# EAGLE design ESP Breakout Adapter - v2_0A - AS1363 (EAGLE 7.3.0)
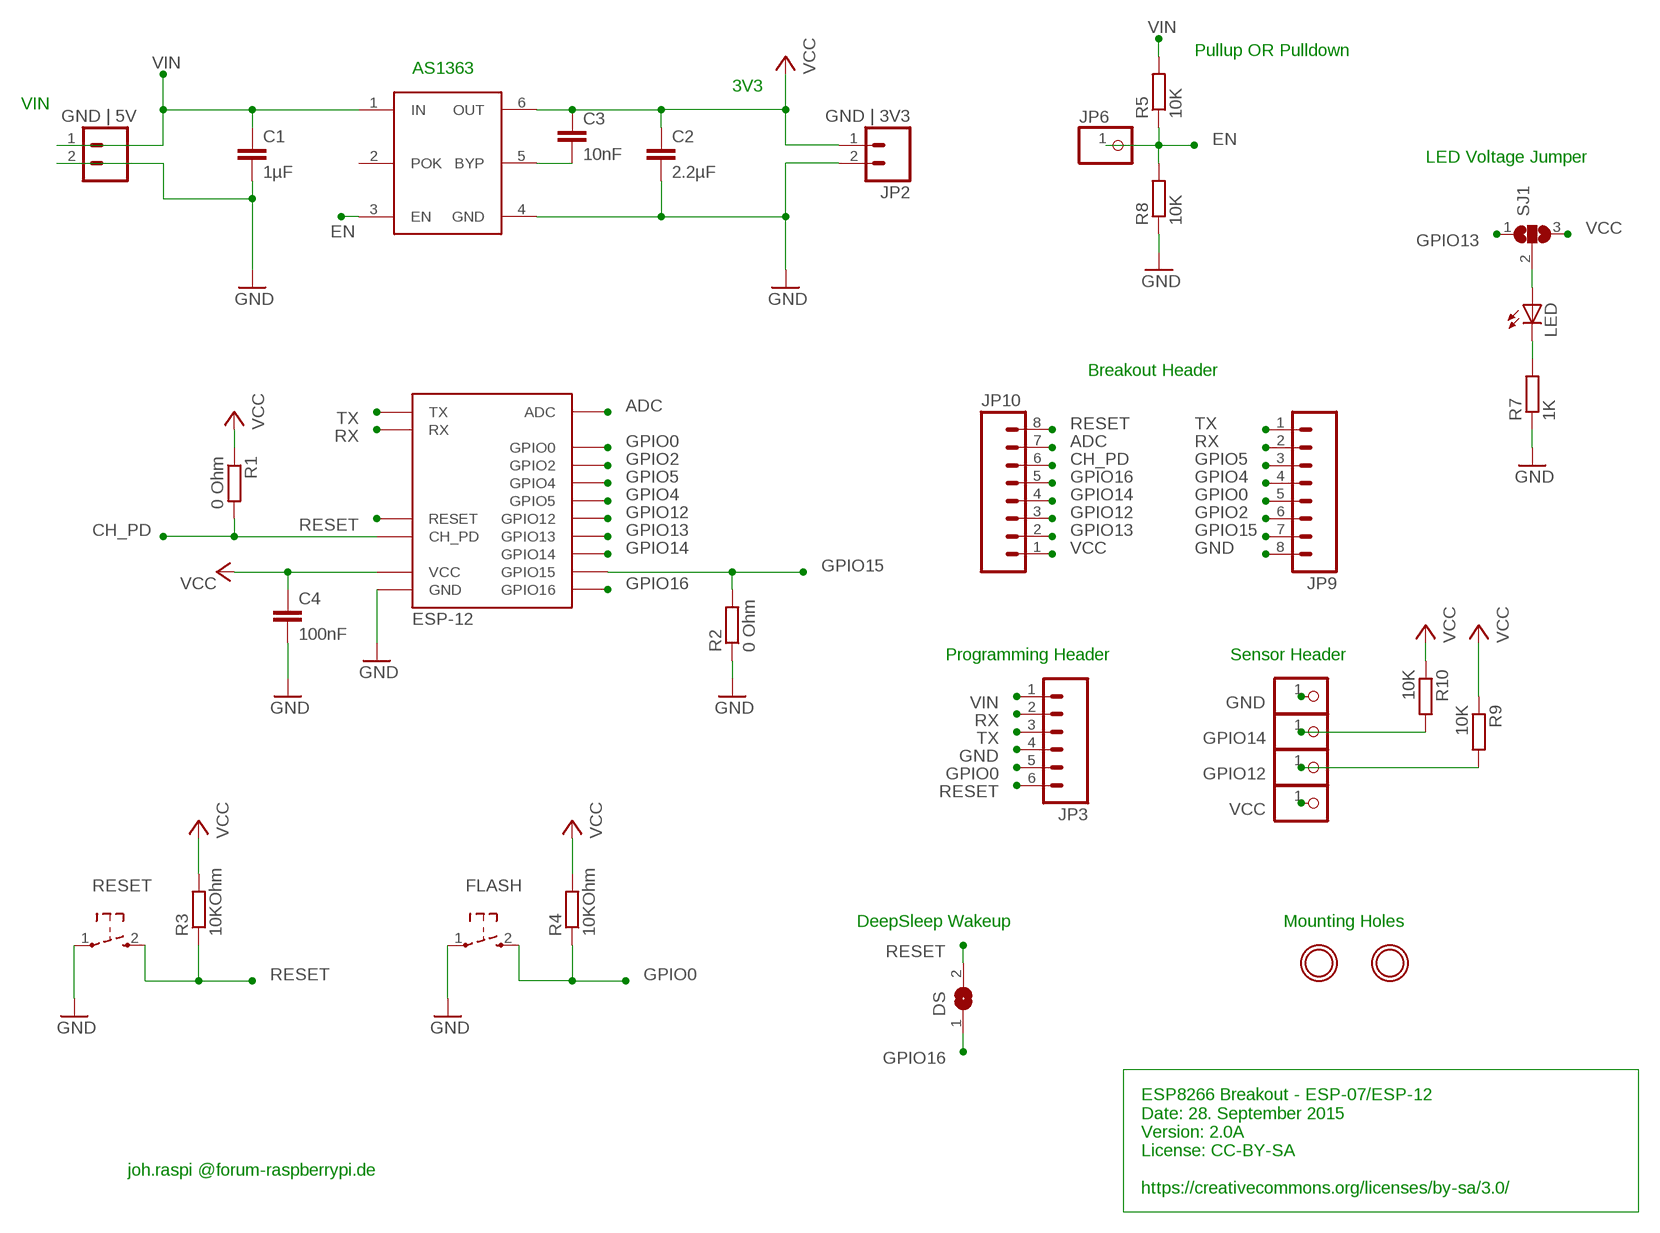
[diagram p0: schematic, sheet 1]

## Parts
AS1363  AS1363  [SOT23-6]
C1  1µF  C-EUC1206  [C1206]
C2  2.2µF  C-EUC1206  [C1206]
C3  10nF  C-EUC0603K  [C0603K]
C4  100nF  C-EUC0805  [C0805]
DS  SJ  [SJ]
FLASH  SW_TACT_2P-3X6  [SW_TACT_3X6]
JP2  GND | 3V3  M02PTH  [1X02]
JP3  M06SIP  [1X06]
JP4  PINHD-1X1  [1X01]
JP6  PINHD-1X1  [1X01]
JP7  PINHD-1X1  [1X01]
JP8  PINHD-1X1  [1X01]
JP9  M081X08  [1X08]
JP10  M081X08  [1X08]
JP11  PINHD-1X1  [1X01]
LED  LED-0805  [LED-805]
R1  0 Ohm  R-EU_R0805  [R0805]
R2  0 Ohm  R-EU_R0805  [R0805]
R3  10KOhm  R-EU_R0805  [R0805]
R4  10KOhm  R-EU_R0805  [R0805]
R5  10K  R-EU_R0805  [R0805]
R7  1K  R-EU_R0805  [R0805]
R8  10K  R-EU_R0805  [R0805]
R9  10K  R-EU_R0805  [R0805]
R10  10K  R-EU_R0805  [R0805]
RESET  SW_TACT_2P-3X6  [SW_TACT_3X6]
SJ1  SJ2W  [SJ_2]
U$1  ESP-12  [ESP-12]
U$4  MOUNTINGHOLE2.0  [MOUNTINGHOLE_2.0_PLATED]
U$5  MOUNTINGHOLE2.0  [MOUNTINGHOLE_2.0_PLATED]
VIN  GND | 5V  M02PTH  [1X02]

## Nets
ADC: JP10.7 U$1.ADC
CH_PD: JP10.6 R1.2 U$1.CH_PD
EN: AS1363.3(EN) JP6.1 R5.1 R8.2
GND [a]: AS1363.4(GND) C1.2 C2.2 C4.2 FLASH.1 JP2.2 JP3.4 JP4.1 JP9.8 R2.1 R7.1 R8.1 RESET.1 U$1.GND VIN.2
GPIO0: FLASH.2 JP3.5 JP9.5 R4.1 U$1.GPIO0
GPIO2: JP9.6 U$1.GPIO2
GPIO4: JP9.4 U$1.GPIO5
GPIO5: JP9.3 U$1.GPIO4
GPIO12: JP7.1 JP10.3 R9.2 U$1.GPIO12
GPIO13: JP10.2 SJ1.1 U$1.GPIO13
GPIO14: JP10.4 JP11.1 R10.2 U$1.GPIO14
GPIO15: JP9.7 R2.2 U$1.GPIO15
GPIO16: DS.1 JP10.5 U$1.GPIO16
N$3: LED.C R7.2
N$4: LED.A SJ1.2
RESET: DS.2 JP3.6 JP10.8 R3.1 RESET.2 U$1.RESET
RX: JP3.2 JP9.2 U$1.RX
SET/BYP: AS1363.5(BYP) C3.2
TX: JP3.3 JP9.1 U$1.TX
VCC: AS1363.6(OUT) C2.1 C3.1 C4.1 JP2.1 JP8.1 JP10.1 R1.1 R3.2 R4.2 R9.1 R10.1 SJ1.3 U$1.VCC
VIN: AS1363.1(IN) C1.1 JP3.1 R5.2 VIN.1
Unconnected: AS1363.2(POK)

## Notes on the sheet
- Pullup OR Pulldown
- AS1363
- 3V3
- VIN
- LED Voltage Jumper
- Breakout Header
- Programming Header | Sensor Header
- DeepSleep Wakeup | Mounting Holes
- joh.raspi @forum-raspberrypi.de
- ESP8266 Breakout - ESP-07/ESP-12
  Date: 28. September 2015
  Version: 2.0A
  License: CC-BY-SA
  
  https://creativecommons.org/licenses/by-sa/3.0/

## Library data of the parts
AS1363 = joh_as1363:AS1363: 500mA ultra-low-dropout linear regulator 1.2V-5V 40µA quiescen current Source: http://ams.com/eng/content/download/12507/219217/12422
C1-C4 = rcl:C-EU: CAPACITOR, European symbol
DS = jumper:SJ: SMD solder JUMPER
FLASH RESET = dp-devices:SW_TACT_2P
JP2 VIN = SparkFun:M02: Header 2 Standard 2-pin 0.1" header. Use with straight break away headers (SKU : PRT-00116), right angle break away headers (PRT-00553), swiss pins (PRT-00743), machine pins (PRT-00117), and female headers (PRT-00115). Molex polarized connector foot print use with SKU : PRT-08233 with associated crimp pins and housings.
JP3 = SparkFun:M06: Header 6 Standard 6-pin 0.1" header. Use with straight break away headers (SKU : PRT-00116), right angle break away headers (PRT-00553), swiss pins (PRT-00743), machine pins (PRT-00117), and female headers (PRT-00115). Molex polarized connector foot print use with SKU : PRT-08094 with associated crimp pins and housings. NOTES ON THE VARIANTS LOCK and LOCK_LONGPADS... This footprint was designed to help hold the alignment of a through-hole component (i.e. 6-pin header) while soldering it into place. You may notice that each hole has been shifted either up or down by 0.005 of an inch from it's more standard position (which is a perfectly straight line). This slight alteration caused the pins (the squares in the middle) to touch the edges of the holes. Because they are alternating, it causes a "brace" to hold the component in place. 0.005 has proven to be the perfect amount of "off-center" position when using our standard breakaway headers. Although looks a little odd when you look at the bare footprint, once you have a header in there, the alteration is very hard to notice. Also, if you push a header all the way into place, it is covered up entirely on the bottom side. This idea of altering the position of holes to aid alignment will be further integrated into the Sparkfun Library for other footprints. It can help hold any component with 3 or more connection pins.
JP4 JP6-JP8 JP11 = pinhead:PINHD-1X1: PIN HEADER
JP9 JP10 = SparkFun:M08: Header 8 Standard 8-pin 0.1" header. Use with straight break away headers (SKU : PRT-00116), right angle break away headers (PRT-00553), swiss pins (PRT-00743), machine pins (PRT-00117), and female headers (PRT-00115).
LED = dp-devices:LED: Light Emitting Diode
R1-R4 R7 = rcl:R-EU_: RESISTOR, European symbol
R5 R8-R10 = resistor:R-EU_: RESISTOR, European symbol
SJ1 = jumper:SJ2W: SMD solder JUMPER
U$1 = johs_esp8266_lib_frank_esp12e_mod:ESP-12: ESP8266 Wifi Module ESP-12; DIMENSIONS: 24.0 x 16.0 mm; PINS: 16; PITCH: 0.078" / 2 mm
U$4 U$5 = microbuilder:MOUNTINGHOLE: Mounting Hole For #2 screws (0.086"/2.18mm width, 0.094"/2.4mm hole) use 2.5mm

## Net classes
1 a: width 0.203 mm, drill 0.305 mm, clearance 0.203 mm

## Board
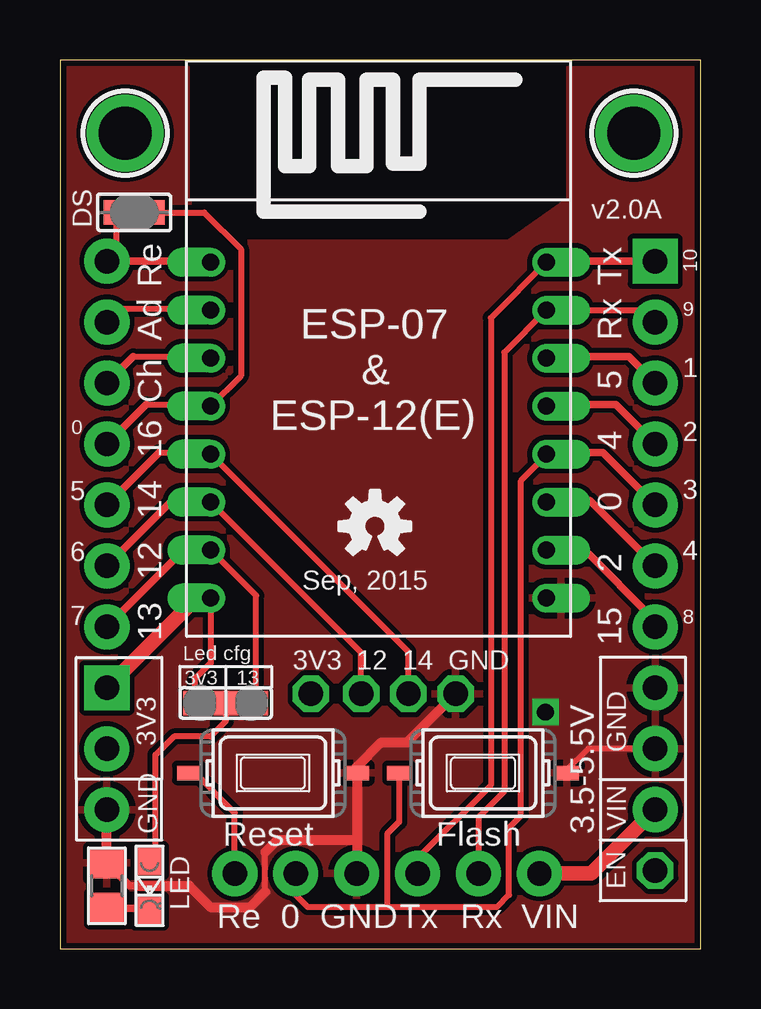
[diagram p1: board, top side]
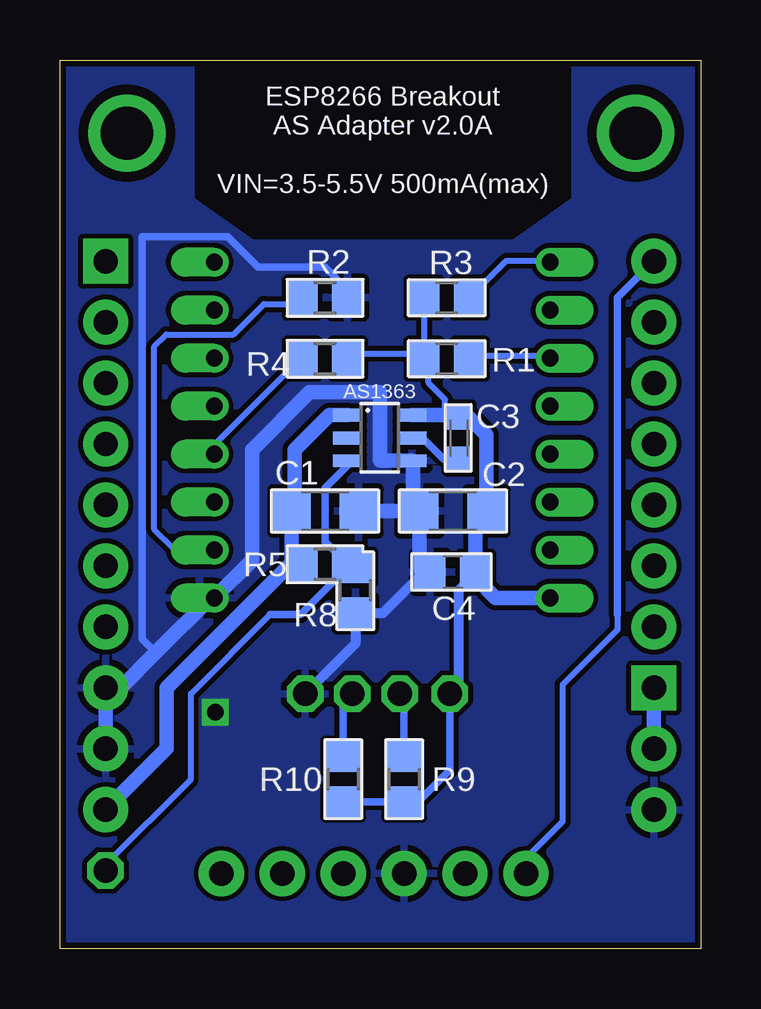
[diagram p2: board, bottom side, seen from below]

Size 26.72 x 37.05 mm. Coordinates in mm from the lower left corner, seen from the top.
Outline: 0,0 26.72,0 26.72,37.06 0,37.06 0,0
Copper layers (1*16): Top 0.035mm / dielectric 1.5mm / Bottom 0.035mm
Design rules "adafruit": minimum track width 10mil, minimum drill 15.5mil, track to track 8mil, track to pad 8mil, pad to pad 8mil, via to via 8mil, smd to smd 8mil, copper to edge 10mil, drill to drill 8mil, minimum pad ring 10mil, minimum via ring 8mil, stop-mask expansion 2mil, vias tented up to drill 20mil, thermal gap 10mil

### Footprints (pad centres in the part's own frame; a part is rotated, then mirrored left to right if it is on the bottom)
SOT23-6 = smd 0.533 x 1.219: 1 -0.95,-1.341; 2 0,-1.341; 3 0.95,-1.341; 4 0.95,1.341; 5 0,1.341; 6 -0.95,1.341
C1206 = smd 1.6 x 1.8: 1 -1.4,0; 2 1.4,0
C0603K = smd 1.05 x 1.08: 1 -0.875,0; 2 0.875,0
C0805 = smd 1.3 x 1.5: 1 -0.95,0; 2 0.95,0
SJ = smd 1.016 x 1.016: 1 -0.762,0; 2 0.762,0
SW_TACT_3X6 = smd 1 x 0.6: 1 -3.5,0; 2 3.5,0
1X02 = drill 1.016 pad 1.88: 1 0,0; 2 2.54,0
1X06 = drill 1.016 pad 1.88: 1 0,0; 2 2.54,0; 3 5.08,0; 4 7.62,0; 5 10.16,0; 6 12.7,0
1X01 = drill 1.016 octagon: 1 0,0
1X08 = drill 1.016 pad 1.88 square: 1 0,0 | drill 1.016 pad 1.88: 2 2.54,0; 3 5.08,0; 4 7.62,0; 5 10.16,0; 6 12.7,0; 7 15.24,0; 8 17.78,0
LED-805 = smd 1.2 x 1.2: A 0,-1.05; C 0,1.05
R0805 = smd 1.3 x 1.5: 1 -0.95,0; 2 0.95,0
SJ_2 = smd 1.016 x 1.016: 1 -1.27,0; 2 0,0; 3 1.27,0
ESP-12 = drill 0.7 offset: ADC -7.1,3.8; CH_PD -7.1,1.8; GND 6.9,-8.2; GPIO0 6.9,-2.2; GPIO2 6.9,-4.2; GPIO4 6.9,1.8; GPIO5 6.9,-0.2; GPIO12 -7.1,-4.2; GPIO13 -7.1,-6.2; GPIO14 -7.1,-2.2; GPIO15 6.9,-6.2; GPIO16 -7.1,-0.2; RESET -7.1,5.8; RX 6.9,3.8; TX 6.9,5.8; VCC -7.1,-8.2
MOUNTINGHOLE_2.0_PLATED = drill 2.2 pad 3: P$1 0,0

### Placement (x,y rotation side)
AS1363  13.39,21.3 270 bottom
C1  15.67,18.25 0 bottom
C2  10.34,18.25 180 bottom
C3  10.08,21.3 270 bottom
C4  10.34,15.71 180 bottom
DS  3.1,30.7 180 top
FLASH  17.64,7.33 180 top
JP2  1.95,8.34 270 top
JP3  19.99,3.14 180 top
JP4  16.5,10.63 0 top
JP6  24.82,3.27 0 top
JP7  12.56,10.63 0 top
JP8  10.47,10.63 0 top
JP9  24.82,28.67 270 top
JP10  1.96,10.89 90 top
JP11  14.53,10.63 0 top
LED  3.73,2.63 180 top
R1  10.59,24.6 0 bottom
R2  15.67,27.14 180 bottom
R3  10.59,27.14 180 bottom
R4  15.67,24.6 0 bottom
R5  15.67,16.03 180 bottom
R7  1.96,2.63 270 top
R8  14.4,14.95 90 bottom
R9  12.37,7.08 90 bottom
R10  14.91,7.08 90 bottom
RESET  8.88,7.33 180 top
SJ1  6.91,10.25 180 top
U$1  13.39,22.82 0 top
U$2  [OSHW-LOGO-S]  13.13,17.62 0 top
U$4  2.72,34 0 top
U$5  23.93,34 0 top
VIN  24.82,5.81 90 top

### Tracks (layer width: path | path; a pad name or v marks a point on that pad's centre or on a via)
ADC
  Top 0.254: 2.51,26.68 6.23,26.68 U$1.ADC
  Top 0.305: 2.51,26.68 JP10.7
CH_PD
  Top 0.254: 3.05,24.68 6.23,24.68 U$1.CH_PD
  Top 0.305: 3.05,24.68 JP10.6
  Bottom 0.254: U$1.CH_PD 6.39,24.73 9.54,24.73 9.54,24.71 R1.2
EN
  Bottom 0.254: 17.96,13.93 21.26,10.63 21.26,7.08 24.82,3.52 JP6.1 | R8.2 14.59,15.9 R5.1
  Bottom 0.305: 17.96,13.93 16.69,13.93 14.72,15.9 14.72,15.97 | 14.72,15.97 R5.1 15.67,16.98 15.67,19.21 14.73,20.16 AS1363.3 | 14.72,15.97
GND  (via drill 0.7)
  Top 0.254: VIN.2 22.03,8.35 21.14,7.46 FLASH.1 | 8.56,2.38 8.56,4.03
  Top 0.305: 3.29,2.63 2.91,2.63 R7.1
  Top 0.406: 12.38,4.54 RESET.1 12.38,7.59 13.39,8.6 14.47,8.6 JP4.1 | 12.38,4.54 JP3.4 | 8.56,2.38 7.93,1.74 6.27,1.74 5.39,2.63 3.29,2.63 | 8.56,4.03 9.07,4.54 12.38,4.54 | R7.1 JP2.2
  Bottom 0.254: 14.72,26.57 R2.1 14.72,27.46
  Bottom 0.305: 14.72,27.46 15.67,28.41 18.47,28.41 19.74,29.68 23.29,29.68 23.29,12.92 22.72,12.35
  Bottom 0.406: C4.2 11.54,15.71 13.25,14 R8.1 14.4,12.73 JP4.1
  Bottom 0.61: 11.99,18.25 C1.2 | 11.99,18.25 C2.2 11.74,15.91 11.48,15.91 C4.2 | VIN.2 JP9.8 24.18,10.89 22.72,12.35 20.45,14.62 U$1.GND 18.72,16.19 18.72,20.79 16.31,23.2 13.39,23.2 13.39,20.35 AS1363.4 11.99,20.3 11.99,18.25
  other vias: 20.24,9.87
  pour Top: 0.18,0.22 26.59,0.22 26.59,36.79 21.26,36.79 21.26,31.21 18.72,29.43 7.8,29.43 5.26,31.21 5.26,36.79 0.18,36.79
  pour Bottom: 0.18,0.22 26.59,0.22 26.59,36.79 21.26,36.79 21.26,31.21 18.72,29.43 7.8,29.43 5.26,31.21 5.26,36.79 0.18,36.79
GPIO0
  Top 0.254: 13.64,1.74 18.21,1.74 18.72,2.25 18.72,5.04 19.23,5.55 19.23,19.52 20.29,20.58 U$1.GPIO0 | 13.64,1.74 10.34,1.74 9.83,2.25 JP3.5 | FLASH.2 14.14,5.29 13.64,4.79 13.64,1.74
  Top 0.305: JP9.5 22.64,20.68 20.35,20.68 U$1.GPIO0
  Bottom 0.254: R4.1 16.69,24.6 20.24,21.05 20.24,20.67 U$1.GPIO0
GPIO2
  Top 0.305: JP9.6 22.1,18.68 20.35,18.68 U$1.GPIO2
GPIO4
  Top 0.305: JP9.4 23.18,22.68 20.35,22.68 U$1.GPIO5
GPIO5
  Top 0.305: JP9.3 23.72,24.68 20.35,24.68 U$1.GPIO4
GPIO12
  Top 0.254: 4.67,18.68 6.23,18.68 U$1.GPIO12 12.56,12.35 JP7.1
  Top 0.305: 4.67,18.68 JP10.3
  Bottom 0.305: R9.2 12.37,10.44 JP7.1
GPIO13
  Top 0.254: 5.21,16.68 6.23,16.68 U$1.GPIO13 8.18,14.73 SJ1.1
  Top 0.305: 5.21,16.68 JP10.2
GPIO14
  Top 0.254: 4.13,20.68 6.23,20.68 U$1.GPIO14 14.53,12.38 JP11.1
  Top 0.305: 4.13,20.68 JP10.4
  Bottom 0.305: R10.2 14.91,10.25 JP11.1
GPIO15
  Top 0.254: 21.81,16.68 20.35,16.68 U$1.GPIO15
  Top 0.305: 21.81,16.68 24.82,13.68 JP9.7
  Bottom 0.254: U$1.GPIO15 21.92,16.62 22.78,17.49 22.78,25.11 22.28,25.62 19.48,25.62 18.21,26.89 16.88,26.89 R2.2
GPIO16
  Top 0.254: 3.59,22.68 6.23,22.68 U$1.GPIO16 7.54,23.88 7.54,29.17 6.02,30.7 DS.1
  Top 0.305: 3.59,22.68 JP10.5
N$3
  Top 0.305: R7.2 3.63,1.68 LED.C
N$4
  Top 0.254: 7.04,10.25 SJ1.2 6.91,9.49 6.27,8.85 4.75,8.85 3.99,8.09 3.99,3.93 LED.A
RESET
  Top 0.254: 6.17,28.67 6.24,28.67 U$1.RESET | RESET.2 5.51,7.46 7.29,5.67 JP3.6 | DS.2 2.34,29.05 JP10.8
  Top 0.305: JP10.8 6.17,28.67
  Bottom 0.254: U$1.RESET 6.35,28.68 8.1,28.68 R3.1 | 3.48,13.93 3.48,13.3 5.77,11.01 5.77,5.3 7.29,3.77 JP3.6
  Bottom 0.305: 3.48,13.93 3.48,27.14 JP10.8
RX
  Top 0.254: JP9.2 24.32,26.62 U$1.RX 18.53,24.87 18.53,6.57 17.45,5.49 JP3.2
  Top 0.305: 24.26,26.68 JP9.2
SET/BYP
  Bottom 0.305: AS1363.5 11.61,21.3 10.73,20.42 C3.2
TX
  Top 0.254: U$1.TX 17.96,26.3 17.96,6.82 14.91,3.77 JP3.3
  Top 0.305: JP9.1 20.33,28.67 U$1.TX
VCC
  Top 0.254: U$1.VCC 6.29,11.91 5.64,11.27 SJ1.3
  Top 0.61: JP10.1 5.75,14.68 6.23,14.68 U$1.VCC
  Bottom 0.254: R3.2 R1.1 11.35,24.79 | 10.67,22.25 10.67,22.9 11.35,23.59 11.35,24.79 | 11.35,24.79 14.91,24.79 R4.2
  Bottom 0.305: JP8.1 10.47,7.46 11.8,6.13 R9.1 R10.1
  Bottom 0.406: JP8.1 10.08,11.01 10.08,14.95 9.64,15.39 9.39,15.65 C4.1
  Bottom 0.61: JP10.1 JP2.1 | AS1363.6 10.67,22.25 10.08,22.25 C3.1 9.69,22.17 8.94,21.42 C2.1 9.39,18.25 C4.1 | U$1.VCC 8.55,14.62 9.32,15.39 9.64,15.39
VIN
  Top 0.61: VIN.1 22.15,3.14 JP3.1
  Bottom 0.305: 17.15,16.09 17.07,16.09
  Bottom 0.61: 17.07,16.09 C1.1 16.94,18.38 16.94,20.79 15.48,22.25 AS1363.1 | 17.07,16.09 22.28,10.89 22.28,8.35 VIN.1 | R5.2 17.01,16.03 17.07,16.09

### Text on the board
tPlace: v2.0A | Re | 10 | Tx | Ad | 9 | Rx | Ch | 1 | 5 | 0 | 16 | 4 | 2 | 5 | 14 | 3 | 0 | 6 | 12 | 2 | 4 | Sep, 2015 | 7 | 13 | 15 | 8 | Led cfg | 3V3 | 12 | 14 | GND | 3v3 | 13 | GND | 3V3 | VIN | GND | 3.5-5.5V | Reset | Flash | EN | LED | Re | 0 | GND | Tx | Rx | VIN
bPlace: ESP8266 Breakout / AS Adapter v2.0A / / VIN=3.5-5.5V 500mA(max) | AS1363